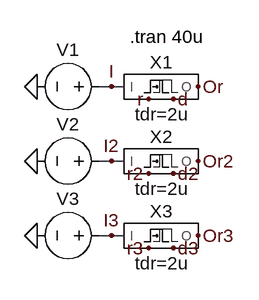
[diagram p0: schematic test-delay-rc-rise.asc]
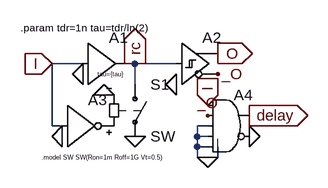
[diagram p1: sub-circuit delay-rc-rise.asc]
test-delay-rc-rise.asc, the LTspice schematic file:
Version 4
SHEET 1 880 680
WIRE 144 272 128 272
WIRE 160 272 144 272
WIRE 144 368 128 368
WIRE 160 368 144 368
WIRE 144 464 128 464
WIRE 160 464 144 464
FLAG 48 272 0
FLAG 144 272 I
FLAG 48 368 0
FLAG 144 368 I2
FLAG 256 272 Or
FLAG 256 368 Or2
FLAG 48 464 0
FLAG 144 464 I3
FLAG 256 464 Or3
FLAG 224 288 d
FLAG 224 384 d2
FLAG 224 480 d3
FLAG 192 288 r
FLAG 192 384 r2
FLAG 192 480 r3
SYMBOL voltage 144 272 M270
WINDOW 0 32 56 VTop 2
WINDOW 3 -32 56 Invisible 2
WINDOW 123 0 0 Left 0
WINDOW 39 0 0 Left 0
SYMATTR InstName V1
SYMATTR Value PULSE(0 1 10u 1n 1n 10u 20u)
SYMBOL voltage 144 368 M270
WINDOW 0 32 56 VTop 2
WINDOW 3 -32 56 Invisible 2
WINDOW 123 0 0 Left 0
WINDOW 39 0 0 Left 0
SYMATTR InstName V2
SYMATTR Value PULSE(0 1 10u 1n 1n 5u 20u)
SYMBOL voltage 144 464 M270
WINDOW 0 32 56 VTop 2
WINDOW 3 -32 56 Invisible 2
WINDOW 123 0 0 Left 0
WINDOW 39 0 0 Left 0
SYMATTR InstName V3
SYMATTR Value PULSE(0 1 10u 1n 1n 5u 20u)
SYMBOL delay-rc-rise 208 272 R0
WINDOW 39 1 51 Bottom 2
SYMATTR InstName X1
SYMATTR SpiceLine tdr=2u
SYMBOL delay-rc-rise 208 368 R0
WINDOW 39 1 51 Bottom 2
SYMATTR InstName X2
SYMATTR SpiceLine tdr=2u
SYMBOL delay-rc-rise 208 464 R0
WINDOW 39 1 51 Bottom 2
SYMATTR InstName X3
SYMATTR SpiceLine tdr=2u
TEXT 168 208 Left 2 !.tran 40u

delay-rc-rise.asc, the sub-circuit schematic file:
Version 4
SHEET 1 880 680
WIRE 144 160 96 160
WIRE 224 160 208 160
WIRE 288 160 224 160
WIRE 224 192 224 160
WIRE 96 256 96 160
WIRE 112 256 96 256
WIRE 336 256 320 256
WIRE 320 272 320 256
WIRE 336 272 320 272
WIRE 320 288 320 272
WIRE 336 288 320 288
WIRE 320 304 320 288
WIRE 336 304 320 304
WIRE 352 304 352 288
WIRE 352 304 336 304
FLAG 144 176 0
FLAG 288 192 0
FLAG 352 144 O
IOPIN 352 144 Out
FLAG 96 160 I
IOPIN 96 160 In
FLAG 176 208 0
FLAG 224 272 0
FLAG 112 272 0
FLAG 336 304 0
FLAG 400 272 0
FLAG 336 224 I
IOPIN 336 224 In
FLAG 336 240 _O
FLAG 352 176 _O
FLAG 400 240 delay
IOPIN 400 240 Out
FLAG 224 160 rc
IOPIN 224 160 Out
SYMBOL Digital\\buf1 144 96 R0
WINDOW 3 22 80 Left 0
SYMATTR Value tau={tau}
SYMATTR InstName A1
SYMBOL sw 224 176 R0
SYMATTR InstName S1
SYMBOL Digital\\inv 112 192 R0
SYMATTR InstName A3
SYMBOL Digital\\and 368 192 R0
SYMATTR InstName A4
SYMBOL Digital\\schmitt 288 96 R0
SYMATTR InstName A2
TEXT 48 104 Left 1 !.param tdr=1n tau=tdr/ln(2)
TEXT 80 304 Left 0 !.model SW SW(Ron=1m Roff=1G Vt=0.5)

The netlist it stands for:
* test-delay-rc-rise.asc
V1 I 0 PULSE(0 1 10u 1n 1n 10u 20u)
V2 I2 0 PULSE(0 1 10u 1n 1n 5u 20u)
V3 I3 0 PULSE(0 1 10u 1n 1n 5u 20u)
XX1 I Or r d delay-rc-rise params: tdr=2u
XX2 I2 Or2 r2 d2 delay-rc-rise params: tdr=2u
XX3 I3 Or3 r3 d3 delay-rc-rise params: tdr=2u

* block symbol definitions
.subckt delay-rc-rise I O rc delay
A1 I 0 0 0 0 0 rc 0 BUF tau={tau}
S1 rc 0 P001 0 SW
A3 I 0 0 0 0 P001 0 0 BUF
A4 I _O 0 0 0 0 delay 0 AND
A2 rc 0 0 0 0 _O O 0 SCHMITT
.param tdr=1n tau=tdr/ln(2)
.model SW SW(Ron=1m Roff=1G Vt=0.5)
.ends delay-rc-rise

.tran 40u
.backanno
.end